# EAGLE design powerswitch (EAGLE 4.13)
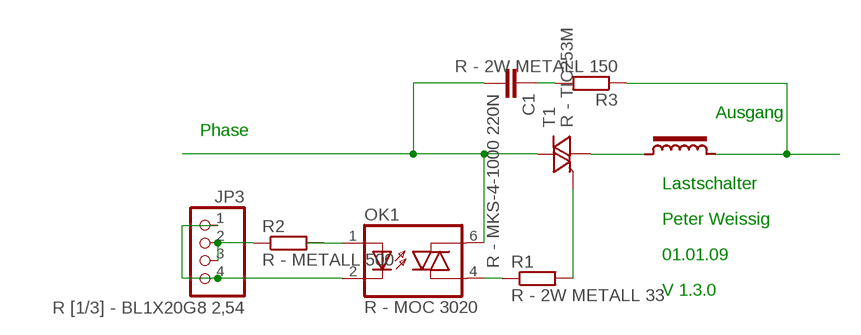
[diagram p0: schematic, sheet 1]

## Parts
C1  R - MKS-4-1000 220N  C-EU225-113X268  [C225-113X268]
JP3  R [1/3] - BL1X20G8 2,54  PINHD-1X4  [1X04]
OK1  R - MOC 3020  IL420  [DIL06]
R1  R - 2W METALL 33  R-EU_0414/15  [0414/15]
R2  R - METALL 500  R-EU_0207/10  [0207/10]
R3  R - 2W METALL 150  R-EU_0414/15  [0414/15]
S1  C - 534455  SPULE-CONRAD-534455  [SPULE-10-16-2.8]
T1  R - TIC253M  TIC253  [TO218DS]

## Nets
LAST: R3.1 S1.P$1
MASSE_CPU: JP3.1 JP3.4 OK1.2(C)
N$1: S1.P$2 T1.A1
N$2: OK1.4(A1) R1.1
N$3: C1.1 R3.2
N$4: JP3.2 JP3.3 R2.1
N$5: OK1.1(A) R2.2
N$7: R1.2 T1.G
PHASE: C1.2 OK1.6(A2) T1.A2

## Notes on the sheet
- Ausgang
- Phase
- Lastschalter
- Peter Weissig
- 01.01.09
- V 1.3.0

## Library data of the parts
C1 = rcl:C-EU: CAPACITOR, European symbol
JP3 = pinhead:PINHD-1X4: PIN HEADER
OK1 = optocoupler:IL420: SIEMENS OPTO COUPLER
R1-R3 = rcl:R-EU_: RESISTOR, European symbol
S1 = Meine eigene:SPULE-CONRAD-534455
T1 = triac:TIC253: TRIAC

## Board
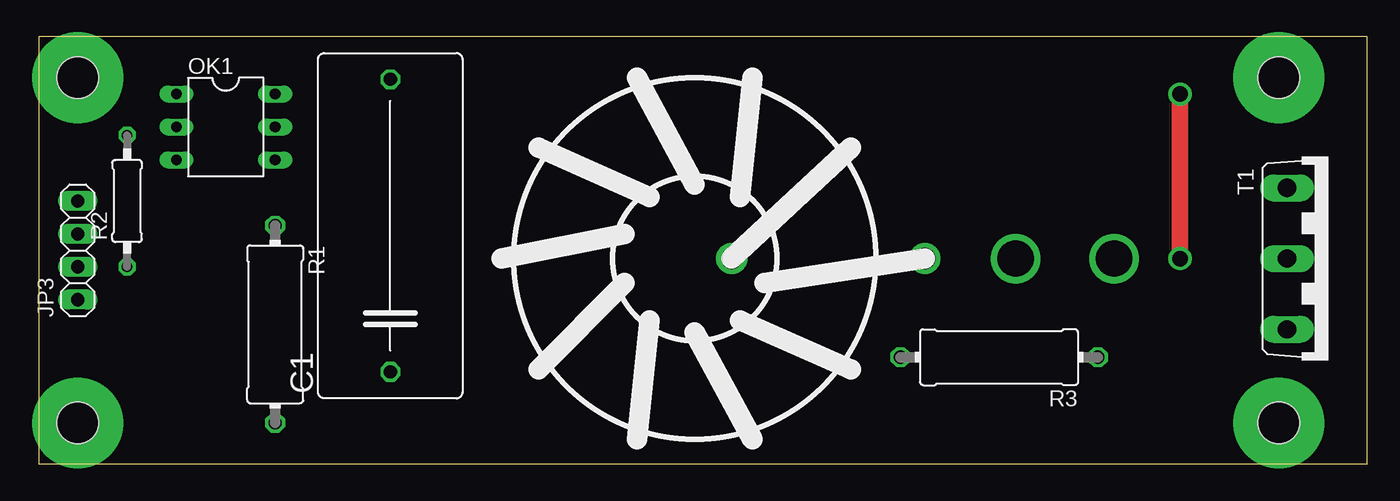
[diagram p1: board, top side]
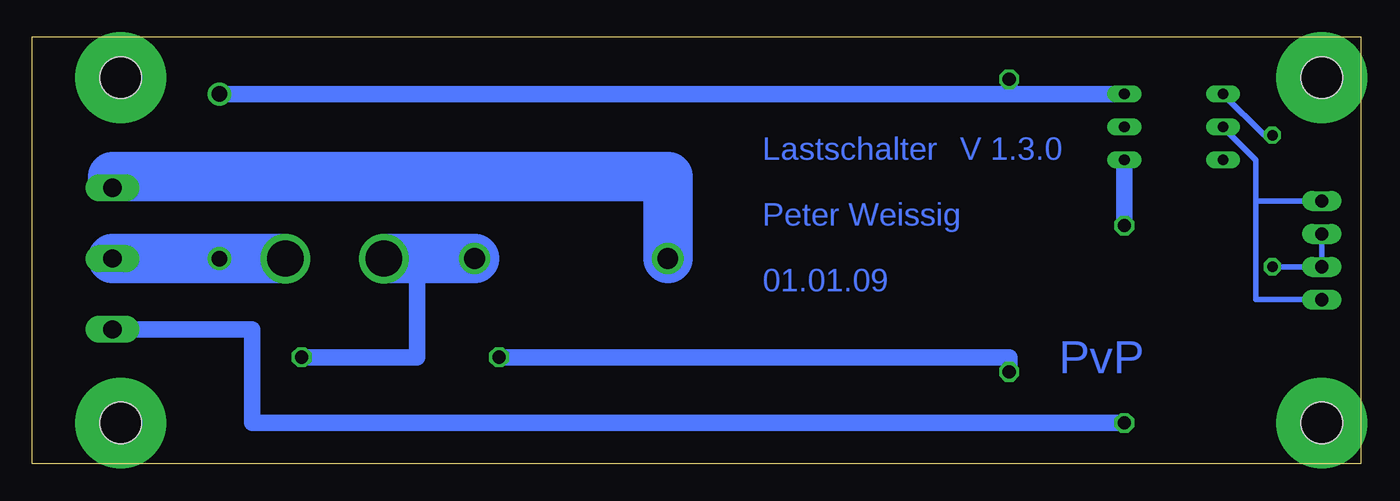
[diagram p2: board, bottom side, seen from below]

Size 102.54 x 33.01 mm. Coordinates in mm from the lower left corner, seen from the top.
Outline: 0,0 102.54,0 102.54,33.01 0,33.01 0,0
Copper layers (1*16): Top 0.035mm / dielectric 1.5mm / Bottom 0.035mm
Design rules "default": minimum track width 10mil, minimum drill 24mil, track to track 8mil, track to pad 8mil, pad to pad 8mil, via to via 8mil, smd to smd 8mil, copper to edge 40mil, drill to drill 8mil, minimum pad ring 10mil, minimum via ring 8mil, stop-mask expansion 4mil, vias tented up to drill 0mil, thermal gap 10mil
Holes 3.2 mm at 3.01,3.17 95.72,3.17 3.01,29.84 95.72,29.84

### Footprints (pad centres in the part's own frame; a part is rotated, then mirrored left to right if it is on the bottom)
C225-113X268 = drill 1.016 octagon: 1 -11.303,0; 2 11.303,0
1X04 = drill 1.016 long: 1 -3.81,0; 2 -1.27,0; 3 1.27,0; 4 3.81,0
DIL06 = drill 0.813 long: 1 -2.54,-3.81; 2 0,-3.81; 3 2.54,-3.81; 4 2.54,3.81; 5 0,3.81; 6 -2.54,3.81
0414/15 = drill 1.016 octagon: 1 -7.62,0; 2 7.62,0
0207/10 = drill 0.813 octagon: 1 -5.08,0; 2 5.08,0
SPULE-10-16-2.8 = drill 1.6 round: P$1 0,17.78; P$2 0,2.857
TO218DS = drill 1.397 long: A1 -5.461,-3.175; A2 0,-3.175; G 5.461,-3.175

### Placement (x,y rotation side)
C1  27.14,18.41 90 top
JP3  3.01,16.5 90 top
OK1  14.44,26.03 270 top
R1  18.25,10.79 270 top
R2  6.82,20.32 90 top
R3  74.13,8.25 180 top
S1  50.63,15.87 270 top
T1  99.53,15.87 270 top

### Tracks (layer width: path | path; a pad name or v marks a point on that pad's centre or on a via)
LAST  (via drill 2.8)
  Bottom 1.27: R3.1 72.86,8.25 72.86,15.87
  Bottom 3.81: S1.P$1 72.86,15.87 v75.4,15.87
MASSE_CPU
  Bottom 0.406: 8.09,20.32 8.09,12.7 JP3.1 | 8.09,20.32 JP3.4 | OK1.2 8.09,23.49 8.09,20.32
N$1
  Bottom 1.016: 96.36,22.22 T1.A1
  Bottom 3.81: S1.P$2 53.49,22.22 95.72,22.22 96.36,22.22
N$2
  Bottom 1.27: R1.1 OK1.4
N$3
  Bottom 1.27: C1.1 27.14,8.25 R3.2
N$4
  Bottom 0.406: JP3.3 JP3.2 R2.1
N$5
  Bottom 0.406: R2.2 7.46,25.39 OK1.1
N$7
  Bottom 1.27: T1.G 85.56,10.41 85.56,3.17 R1.2
N$13  (via drill 2.8 pad 7)
  other vias: 95.72,3.17 95.72,29.84
N$15  (via drill 2.8 pad 7)
  other vias: 3.01,3.17
N$16  (via drill 2.8 pad 7)
  other vias: 3.01,29.84
PHASE  (via drill 1.2, 2.8)
  Top 1.27: v88.1,28.57 v88.1,15.87
  Bottom 1.016: 83.02,17.14 v88.1,15.87 v83.02,15.87
  Bottom 1.27: OK1.6 27.14,28.57 | 27.14,28.57 C1.2 | 27.14,28.57 v88.1,28.57
  Bottom 3.81: v83.02,15.87 v88.1,15.87 T1.A2

### Text on the board
Bottom: V 1.3.0 | Lastschalter | Peter Weissig | 01.01.09 | PvP